# EasyEDA Pro project 碳化硅3KW图腾柱PFC_2025-04-21.epro, schematic Schematic1_1, sheets 4 to 6 of 6

## Sheets
4 驱动器: Page Name: 驱动器; Update Date: 2025-03-09
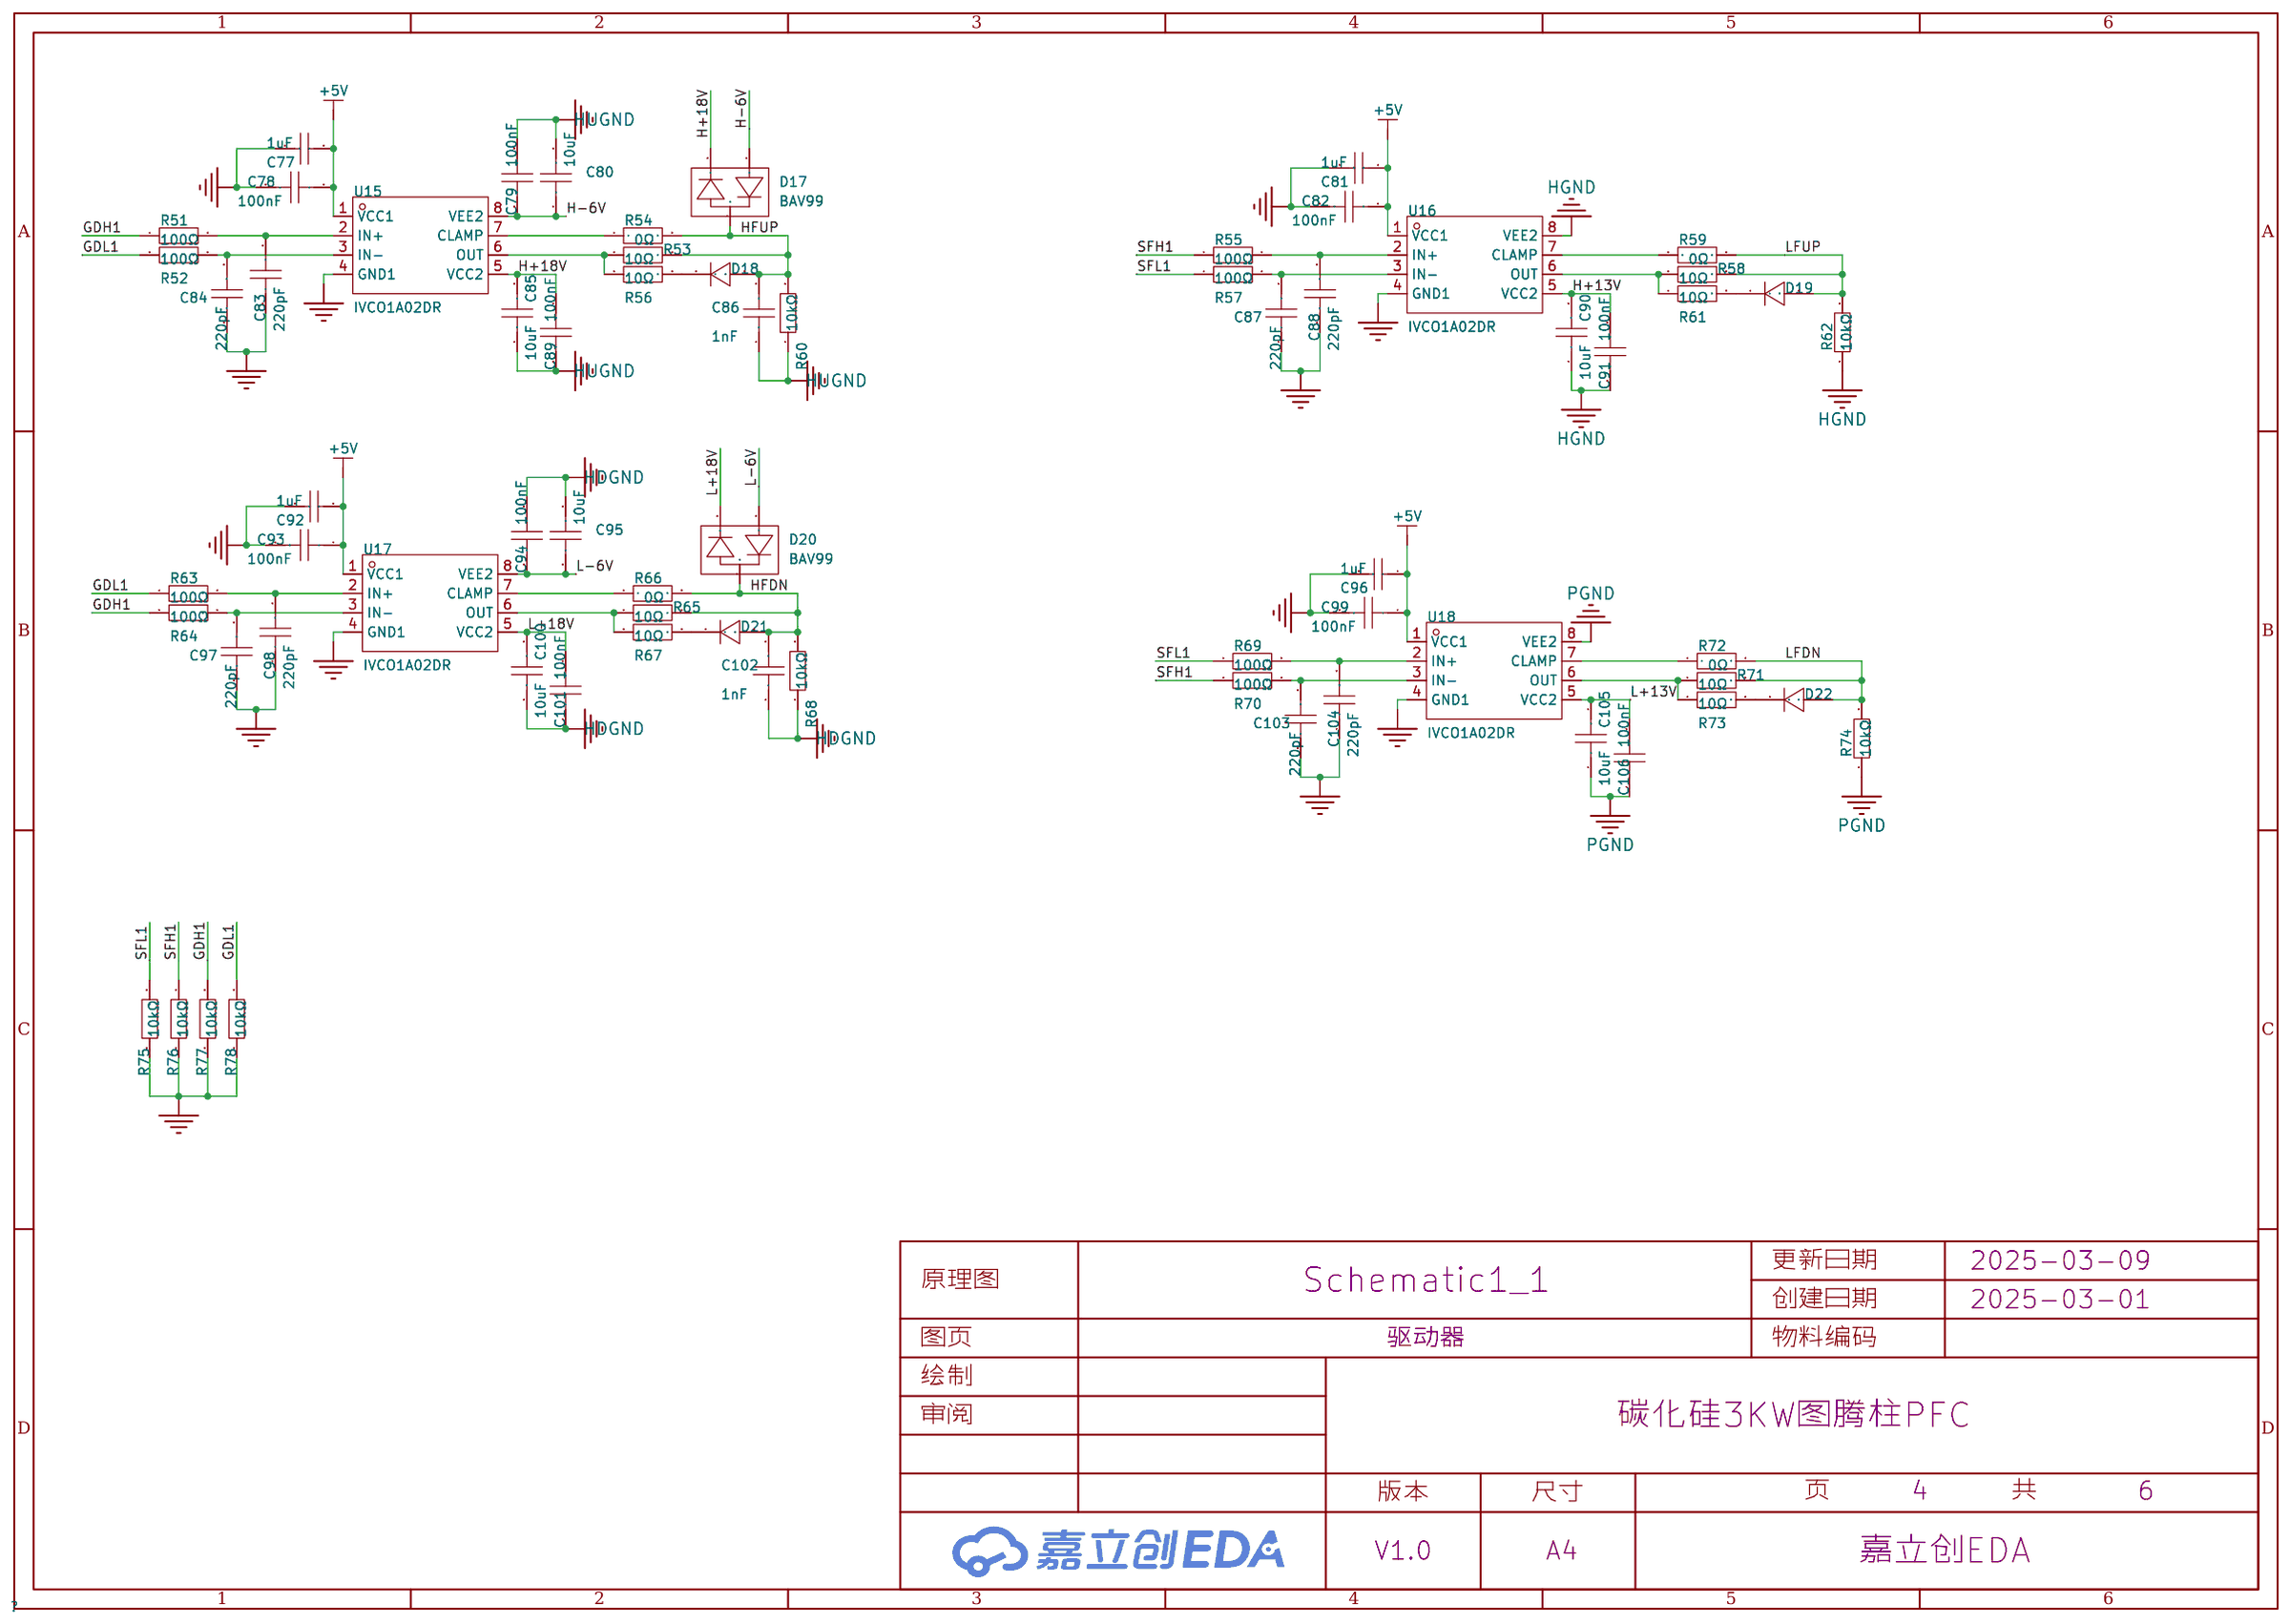
[diagram p3: 驱动器]
5 CW32主控: Create Date: 2024-07-14; Page Name: CW32主控; Project Name: 采用碳化硅的3KW图腾柱PFC; Update Date: 2024-07-19
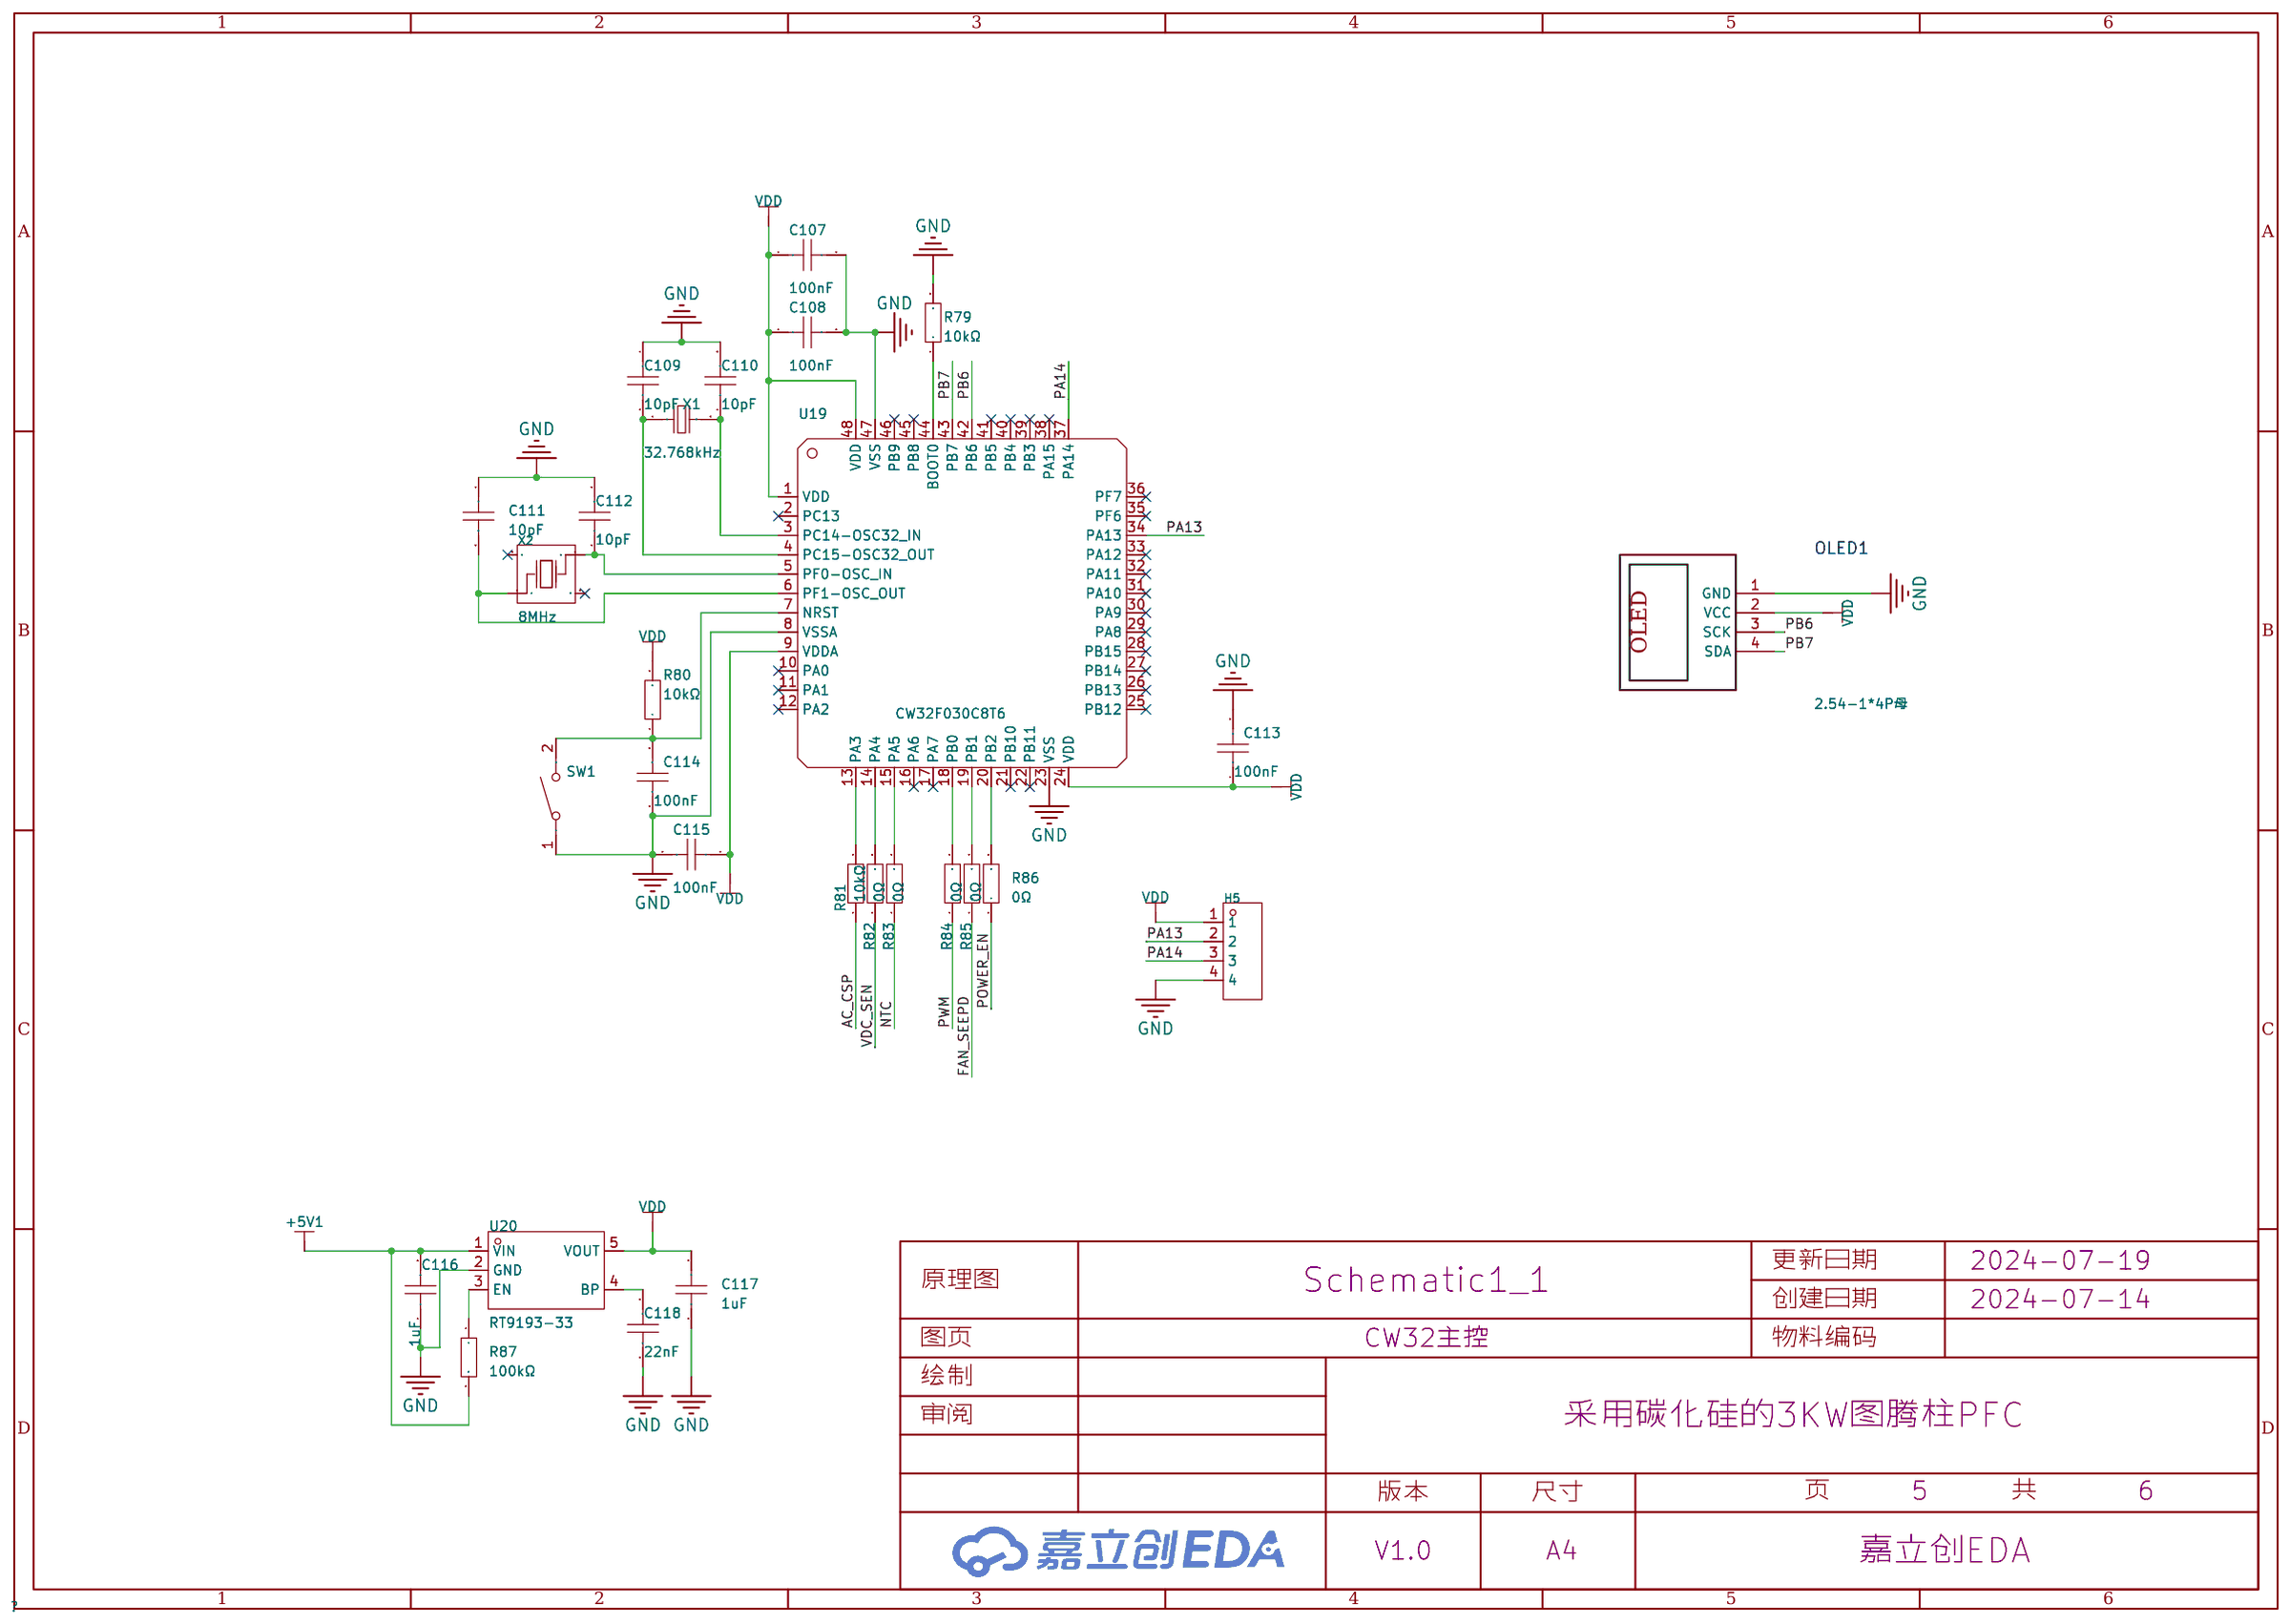
[diagram p4: CW32主控]
6 采样: Create Date: 2024-07-14; Page Name: 采样; Project Name: 采用碳化硅的3KW图腾柱PFC; Update Date: 2024-08-04
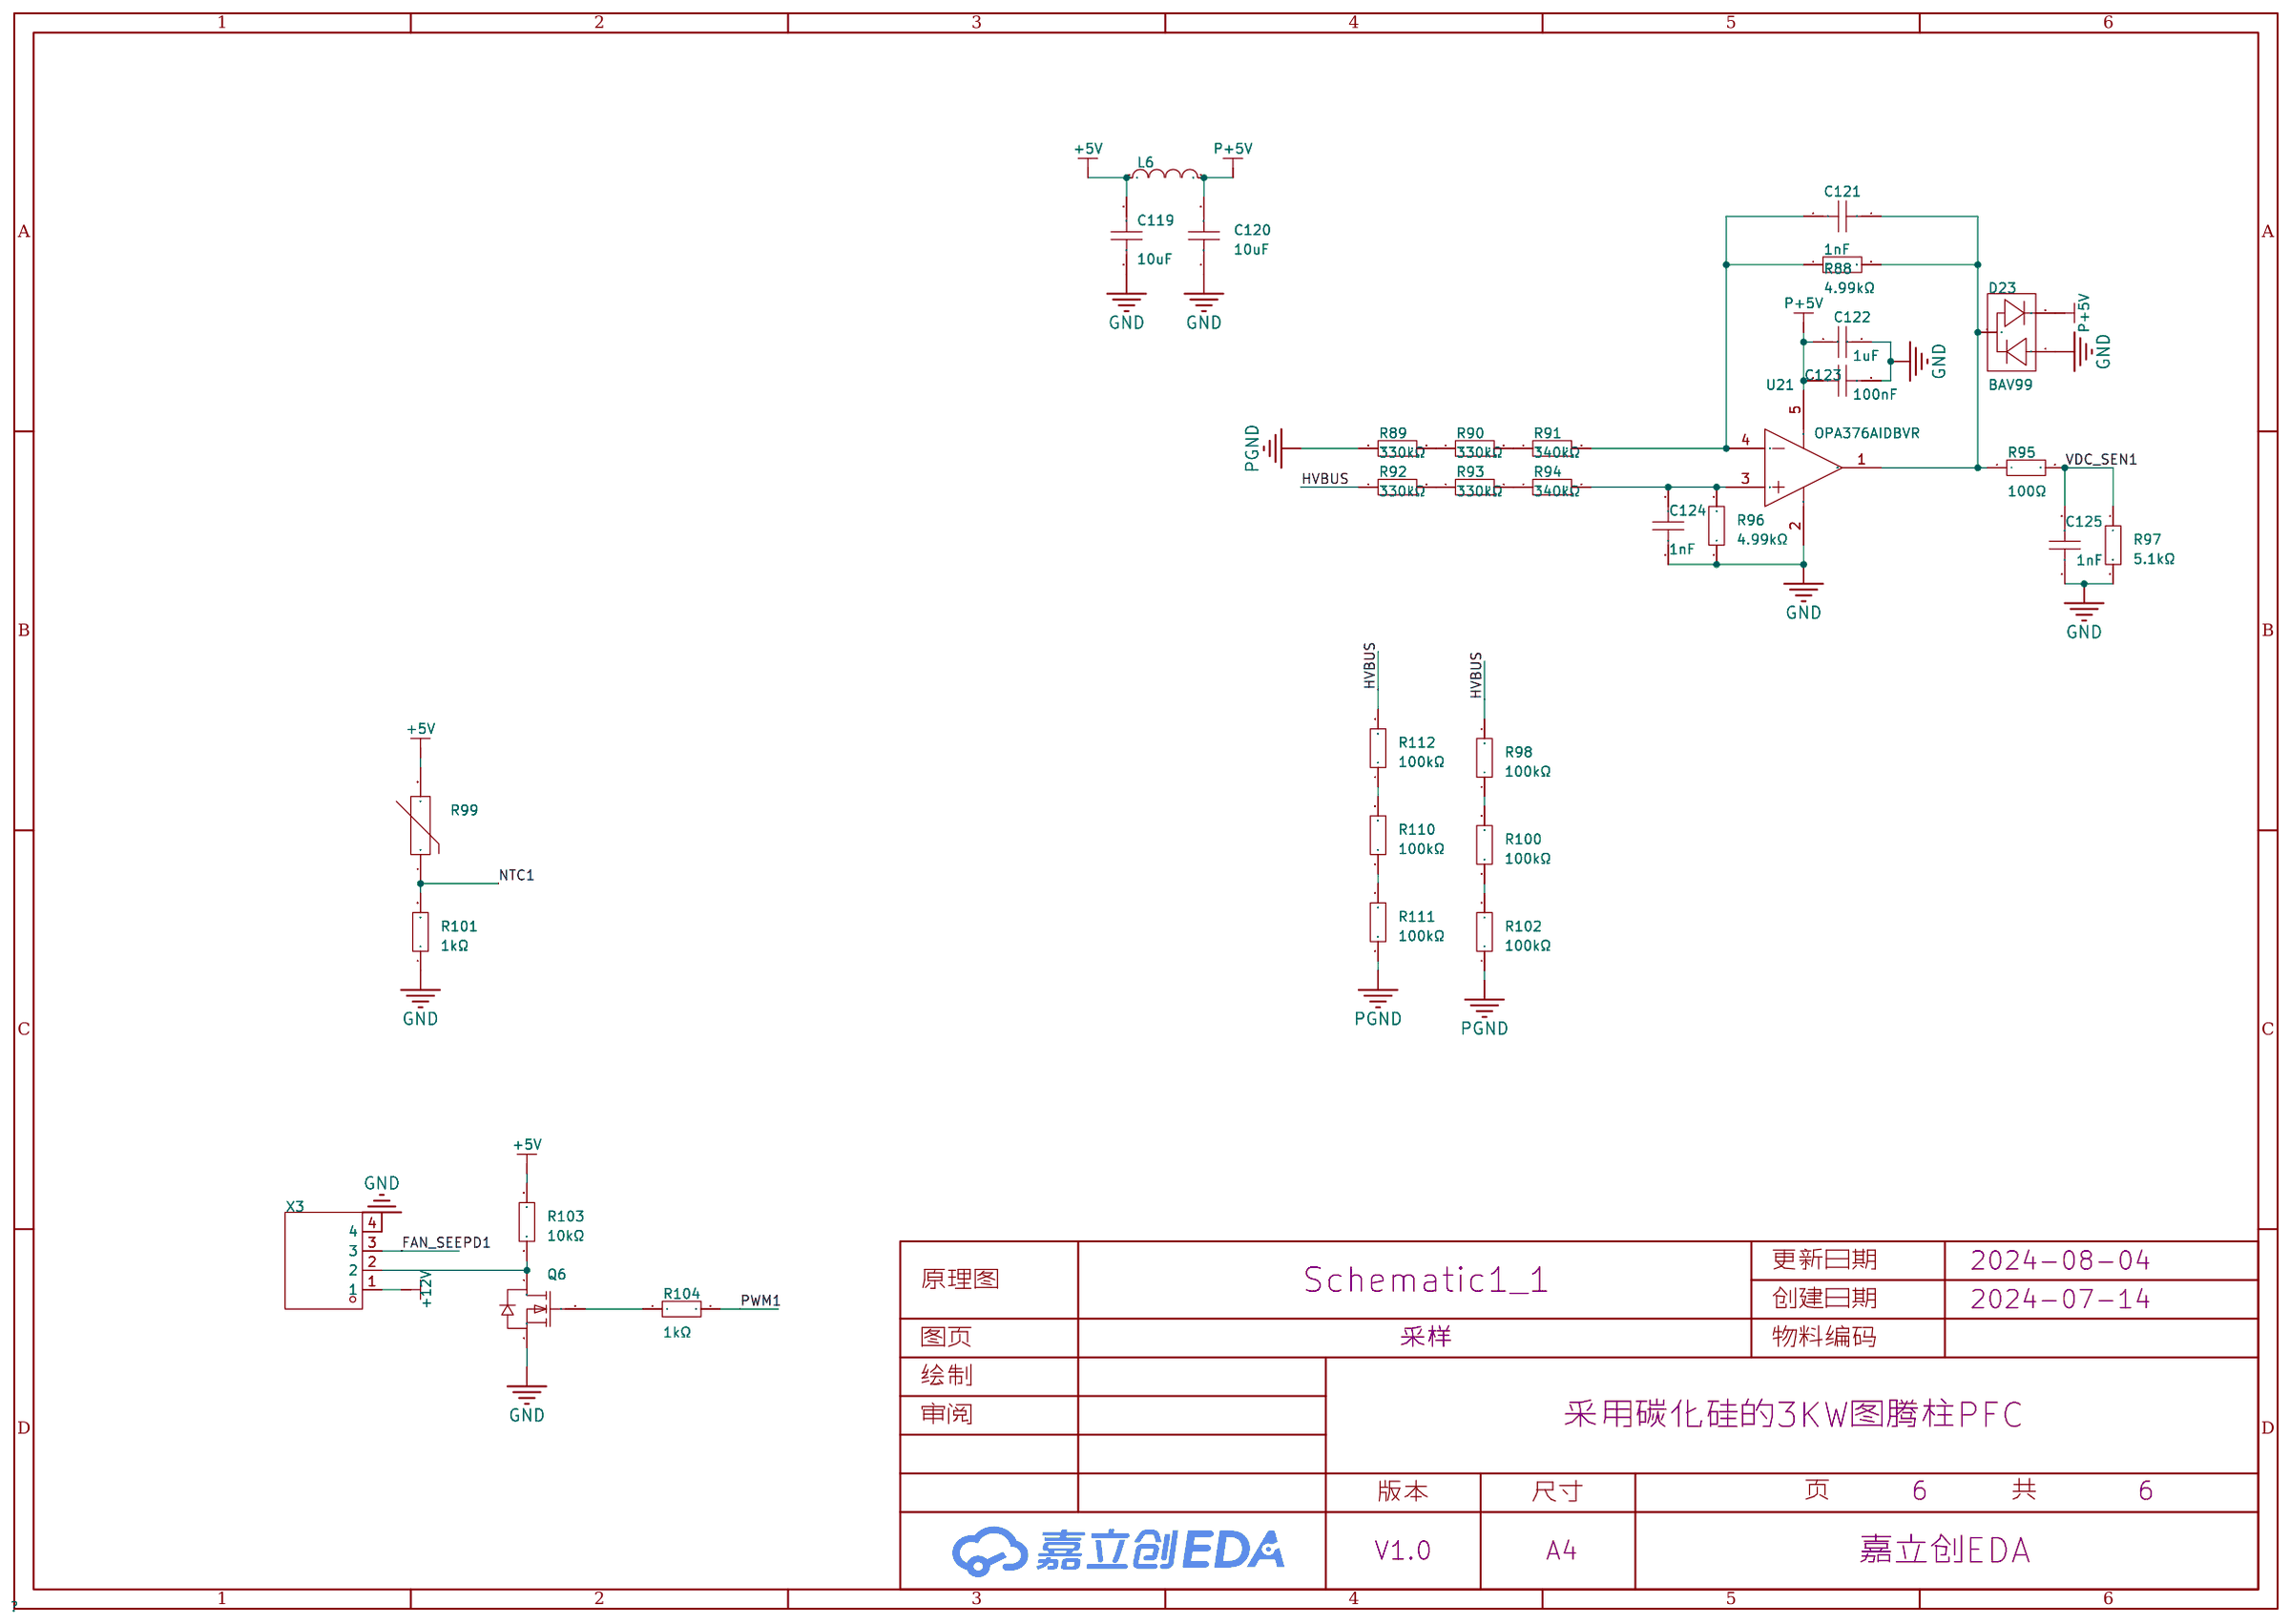
[diagram p5: 采样]

## Parts
sheet CW32主控
C107  100nF  [C0603]
C108  100nF  [C0603]
C109  10pF  [C0603]
C110  10pF  [C0603]
C111  10pF  [C0603]
C112  10pF  [C0603]
C113  100nF  [C0603]
C114  100nF  [C0603]
C115  100nF  [C0603]
C116  1uF  [C0603]
C117  1uF  [C0603]
C118  22nF  [C0603]
H5  -  [HDR-TH_4P-P2.54-V-M]
OLED1  2.54-1*4P母  [HDR-TH_4P-P2.54-V-F]
R79  10kΩ  [R0603]
R80  10kΩ  [R0603]
R81  10kΩ  [R0603]
R82  0Ω  [R0603]
R83  0Ω  [R0603]
R84  0Ω  [R0603]
R85  0Ω  [R0603]
R86  0Ω  [R0603]
R87  100kΩ  [R0603]
SW1  TS-1185EC-C-D-B  [SW-SMD_4P-L3.7-W3.0-P1.50-LS4.7]
U19  CW32F030C8T6  [LQFP-48_L7.0-W7.0-P0.50-LS9.0-TL]
U20  RT9193-33  [SOT-23-5_L2.9-W1.6-P0.95-LS2.8-TL]
X1  32.768kHz  [FC-135R_L3.2-W1.5]
X2  8MHz  [OSC-SMD_4P-L3.2-W2.5-BL]
sheet 采样
C119  10uF  [C0603]
C120  10uF  [C0603]
C121  1nF  [C0603]
C122  1uF  [C0603]
C123  100nF  [C0603]
C124  1nF  [C0603]
C125  1nF  [C0603]
D23  BAV99  [SOT-23-3_L2.9-W1.3-P1.90-LS2.4-BR]
L6  PBY160808T-601Y-N  [L0603]
Q6  2N7002  [SOT-23-3_L2.9-W1.3-P1.90-LS2.4-BR]
R88  4.99kΩ  [R0603]
R89  330kΩ  [R1206]
R90  330kΩ  [R1206]
R91  340kΩ  [R1206]
R92  330kΩ  [R1206]
R93  330kΩ  [R1206]
R94  340kΩ  [R1206]
R95  100Ω  [R0603]
R96  4.99kΩ  [R0603]
R97  5.1kΩ  [R0603]
R98  100kΩ  [R1206]
R99  MF52A103F3950 (A1)  [RES-TH_L2.5-W2.5-P1.70-D0.3]
R100  100kΩ  [R1206]
R101  1kΩ  [R0603]
R102  100kΩ  [R1206]
R103  10kΩ  [R0603]
R104  1kΩ  [R0603]
R110  100kΩ  [R1206]
R111  100kΩ  [R1206]
R112  100kΩ  [R1206]
U21  OPA376AIDBVR  [SOT-23-5_L3.0-W1.7-P0.95-LS2.8-BR]
X3  B04B-XASK-1(LF)(SN)  [CONN-TH_B04B-XASK-1-LF-SN]
sheet 驱动器
C77  1uF  [C0603]
C78  100nF  [C0603]
C79  100nF  [C0603]
C80  10uF  [C0603]
C81  1uF  [C0603]
C82  100nF  [C0603]
C83  220pF  [C0603]
C84  220pF  [C0603]
C85  10uF  [C1206]
C86  1nF  [C0603]
C87  220pF  [C0603]
C88  220pF  [C0603]
C89  100nF  [C0603]
C90  10uF  [C1206]
C91  100nF  [C0603]
C92  1uF  [C0603]
C93  100nF  [C0603]
C94  100nF  [C0603]
C95  10uF  [C0603]
C96  1uF  [C0603]
C97  220pF  [C0603]
C98  220pF  [C0603]
C99  100nF  [C0603]
C100  10uF  [C1206]
C101  100nF  [C0603]
C102  1nF  [C0603]
C103  220pF  [C0603]
C104  220pF  [C0603]
C105  10uF  [C1206]
C106  100nF  [C0603]
D17  BAV99  [SOT-23-3_L2.9-W1.3-P1.90-LS2.4-BR]
D18  SODSF14-SH  [SOD-123FL_L2.8-W1.8-LS3.7-RD-1]
D19  SODSF14-SH  [SOD-123FL_L2.8-W1.8-LS3.7-RD-1]
D20  BAV99  [SOT-23-3_L2.9-W1.3-P1.90-LS2.4-BR]
D21  SODSF14-SH  [SOD-123FL_L2.8-W1.8-LS3.7-RD-1]
D22  SODSF14-SH  [SOD-123FL_L2.8-W1.8-LS3.7-RD-1]
R51  100Ω  [R0603]
R52  100Ω  [R0603]
R53  10Ω  [R1206]
R54  0Ω  [R0805]
R55  100Ω  [R0603]
R56  10Ω  [R1206]
R57  100Ω  [R0603]
R58  10Ω  [R1206]
R59  0Ω  [R0805]
R60  10kΩ  [R0603]
R61  10Ω  [R1206]
R62  10kΩ  [R0603]
R63  100Ω  [R0603]
R64  100Ω  [R0603]
R65  10Ω  [R1206]
R66  0Ω  [R0805]
R67  10Ω  [R1206]
R68  10kΩ  [R0603]
R69  100Ω  [R0603]
R70  100Ω  [R0603]
R71  10Ω  [R1206]
R72  0Ω  [R0805]
R73  10Ω  [R1206]
R74  10kΩ  [R0603]
R75  10kΩ  [R0603]
R76  10kΩ  [R0603]
R77  10kΩ  [R0603]
R78  10kΩ  [R0603]
U15  IVCO1A02DR  [SOIC-8_L4.9-W4.0-P1.27-LS6.0-BL]
U16  IVCO1A02DR  [SOIC-8_L4.9-W4.0-P1.27-LS6.0-BL]
U17  IVCO1A02DR  [SOIC-8_L4.9-W4.0-P1.27-LS6.0-BL]
U18  IVCO1A02DR  [SOIC-8_L4.9-W4.0-P1.27-LS6.0-BL]

## Library data of the parts
C78 C79 C82 C89 C91 C93 C94 C99 C101 C106-C108 C113-C115 C123 = CC0603KRX7R9BB104: 容值:100nF;精度:±10%;额定电压:50V;材质(温度系数):X7R;; LCSC Part Name: 100nF ±10% 50V; Supplier Part: C14663; Manufacturer: YAGEO(国巨); Supplier Footprint: 0603; JLCPCB Part Class: Basic Part; Datasheet: https://atta.szlcsc.com/upload/public/pdf/source/20180910/C282072_33301C7F631E79921B82A8DAC6BCC5B3.pdf; Supplier: LCSC; Tolerance: ±10%; Voltage Rated: 50V; Temperature Coefficient: X7R
C109-C112 = CL10C100JB8NNNC: 容值:10pF;精度:±5%;额定电压:50V;材质(温度系数):C0G;; LCSC Part Name: 10pF ±5% 50V; Supplier Part: C1634; Manufacturer: SAMSUNG(三星); Supplier Footprint: 0603; JLCPCB Part Class: Basic Part; Datasheet: https://atta.szlcsc.com/upload/public/pdf/source/20160218/1457707763339.pdf; Supplier: LCSC; Tolerance: ±5%; Voltage Rated: 50V; Temperature Coefficient: C0G
C116 C117 = CL10A105KB8NNNC: 容值:1uF;精度:±10%;额定电压:50V;材质(温度系数):X5R;; LCSC Part Name: 1uF ±10% 50V; Supplier Part: C15849; Manufacturer: SAMSUNG(三星); Supplier Footprint: 0603; JLCPCB Part Class: Basic Part; Datasheet: https://atta.szlcsc.com/upload/public/pdf/source/20160218/1457707763339.pdf; Supplier: LCSC; Tolerance: ±10%; Voltage Rated: 50V; Temperature Coefficient: X5R
C118 = CL10B223KB8NNNC: 容值:22nF;精度:±10%;额定电压:50V;材质(温度系数):X7R;; LCSC Part Name: 22nF ±10% 50V; Supplier Part: C21122; Manufacturer: SAMSUNG(三星); Supplier Footprint: 0603; JLCPCB Part Class: Basic Part; Datasheet: https://atta.szlcsc.com/upload/public/pdf/source/20160218/1457707763339.pdf; Supplier: LCSC; Tolerance: ±10%; Voltage Rated: 50V; Temperature Coefficient: X7R
H5 = HDR-M_2.54_1x4P: Supplier Part: C492403; Supplier Footprint: 插件
OLED1 = 2.54-1*4P母: 插孔结构:1x4P;间距:2.54mm;行距:-;圆孔/方孔:方孔;安装类型:直插;排数:单排;总孔位数:4P;额定电流:3A;额定电压:-;插孔方向:顶部;塑高:-;触头材质:青铜;触头镀层:-;工作温度范围:-40℃~+105℃;焊接温度(最大值):-;; LCSC Part Name: 间距:2.54mm 1x4P 直插; Supplier Part: C2718488; Manufacturer: BOOMELE(博穆精密); Supplier Footprint: 插件,P=2.54mm; JLCPCB Part Class: Extended Part; Datasheet: https://atta.szlcsc.com/upload/public/pdf/source/20210301/C2718488_F4427B881E42CAA8DDB0B1C12B3A522C.pdf; Supplier: LCSC; Holes Structure: 1x4P; Pitch: 2.54mm; Circular Hole / Square Hole: 方孔; Mounting Type: 直插; Number of Rows: 单排; Number of Holes: 4P; Current Rating (Max): 3A; Holes Direction: 顶部; Contact Material: 青铜; Operating Temperature Range: -40℃~+105℃
R60 R62 R68 R74-R81 R103 = 0603WAF1002T5E: 电阻类型:厚膜电阻;阻值:10kΩ;精度:±1%;功率:100mW;最大工作电压:75V;温度系数:±100ppm/℃;; LCSC Part Name: 厚膜电阻 10kΩ ±1% 100mW; Supplier Part: C25804; Manufacturer: UNI-ROYAL(厚声); Supplier Footprint: 0603; JLCPCB Part Class: Basic Part; Datasheet: https://atta.szlcsc.com/upload/public/pdf/source/20200306/C422600_1E6D84923E4A46A82E41ADD87F860B5C.pdf; Supplier: LCSC; Type: 厚膜电阻; Tolerance: ±1%; Power(Watts): 100mW; Overload Voltage (Max): 75V; Temperature Coefficient: ±100ppm/℃; Operating Temperature Range: -55℃~+155℃
R82-R86 = 0603WAF0000T5E: 电阻类型:厚膜电阻;阻值:0Ω;精度:±1%;功率:100mW;最大工作电压:75V;; LCSC Part Name: 0Ω ±1% 100mW 厚膜电阻; Supplier Part: C21189; Manufacturer: UNI-ROYAL(厚声); Supplier Footprint: 0603; JLCPCB Part Class: Basic Part; Datasheet: https://atta.szlcsc.com/upload/public/pdf/source/20200306/C422600_1E6D84923E4A46A82E41ADD87F860B5C.pdf; Supplier: LCSC; Type: 厚膜电阻; Tolerance: ±1%; Power(Watts): 100mW; Overload Voltage (Max): 75V; Operating Temperature Range: -55℃~+155℃
R87 = 0603WAF1003T5E: 电阻类型:厚膜电阻;阻值:100kΩ;精度:±1%;功率:100mW;最大工作电压:75V;温度系数:±100ppm/℃;; LCSC Part Name: 100kΩ ±1% 100mW 厚膜电阻; Supplier Part: C25803; Manufacturer: UNI-ROYAL(厚声); Supplier Footprint: 0603; JLCPCB Part Class: Basic Part; Datasheet: https://atta.szlcsc.com/upload/public/pdf/source/20200306/C422600_1E6D84923E4A46A82E41ADD87F860B5C.pdf; Supplier: LCSC; Type: 厚膜电阻; Tolerance: ±1%; Power(Watts): 100mW; Overload Voltage (Max): 75V; Temperature Coefficient: ±100ppm/℃; Operating Temperature Range: -55℃~+155℃
SW1 = TS-1185EC-C-D-B: 触点电流:50mA;额定电压(DC):12V;绝缘电阻:-;电路结构:单刀单掷;安装方式:立贴;带灯:无;作用力:260gf;机械寿命:10万次;带支架:否;; LCSC Part Name: 3.65*3*2mm 立贴 轻触开关; Supplier Part: C318893; Manufacturer: XKB Connectivity(中国星坤); Supplier Footprint: SMD; JLCPCB Part Class: 扩展库; Datasheet: https://atta.szlcsc.com/upload/public/pdf/source/20211011/37251E5FC3BB5C155D4391B78D14163F.pdf; Supplier: LCSC; Contact Current: 50mA; Voltage Rating (DC): 12V; Circuit: 单刀单掷; Mounting Style: 立贴; Actuator Style: 圆形按钮; Actuator/Cap Color: 黑色; With Lamp: 无; Operating Force: 260gf; Mechanical Life: 10万次; Operating Temperature: -30℃~+85℃; Switch Length: 3.65mm; Switch Width: 3mm; Switch Height: 2mm; Strike Gundam: 否
U19 = CW32F030C8T6_C3019113: CPU内核:ARM Cortex-M0+;CPU最大主频:64MHz;工作电压范围:1.65V~5.5V;内部振荡器:有;外部时钟频率范围:4MHz~32MHz;程序 FLASH容量:-;RAM总容量:8KB;EEPROM/数据 FLASH容量:-;GPIO端口数量:39;ADC(单元数/通道数/位数):1@x16ch/12bit;DAC(单元数/通道数/位数):-;(E)PWM(单元数/通道数/位数):-;8位Timer数量:-;16位Timer数量:8;32位Timer数量:-;内部比较器数量:2;U; LCSC Part Name: ARM Cortex-M0+ 64MHz RAM：8KB; Supplier Part: C3019113; Manufacturer: CW(芯源); Supplier Footprint: LQFP-48; Datasheet: https://atta.szlcsc.com/upload/public/pdf/source/20220516/D60F5E1023A73FFF550D4A77416DDFBC.pdf; Supplier: LCSC; CPU Core: ARM Cortex-M0+; Maximum Frequency: 64MHz; Supply Voltage Range: 1.65V~5.5V; Internal Oscillator: 有; External Clock Frequency Rang: 4MHz~32MHz; RAM Size: 8KB; GPIO Ports Number: 39; ADC (Units/Channels/bits): 1@x16ch/12bit; 16Bit Timer Number: 8; CMP Number: 2; U(S)ART Number: 3; I2C Number: 2; (Q)SPI Number: 2; Peripherals / Functions / Protocol Stacks: 片载温度传感器；DMA；看门狗；低电压检测；CRC校验; Operating Temperature Range: -40℃~105℃
U20 = RT9193-33_C9900006434: Supplier Part: C9900006434; Supplier Footprint: LC-SOT-23-5; JLCPCB Part Class: 扩展库; Supplier: LCSC
X1 = Q13FC1350000400: 晶振类型:贴片晶振;频率:32.768kHz;常温频差:±20ppm;外接负载电容:12.5pF;; LCSC Part Name: 32.768kHz ±20ppm 12.5pF; Supplier Part: C32346; Manufacturer: EPSON(爱普生); Manufacturer Part: Q13FC13500004; Supplier Footprint: SMD3215-2P; JLCPCB Part Class: Basic Part; Datasheet: https://atta.szlcsc.com/upload/public/pdf/source/20240418/0E0FF5F0356BA3753F616001439D1416.pdf; Supplier: LCSC; Crystal Type: 贴片晶振; Frequency Tolerance: ±20ppm; Load Capacitance: 12.5pF; Equivalent Series Resistance (ESR): 70kΩ; Operating Temperature: -40℃~+85℃; Normal temperature Frequency Tolerance: ±20ppm; External load capacitor: 12.5pF
X2 = TAXM8M4RDBCCT2T: 晶振类型:贴片晶振;频率:8MHz;常温频差:±10ppm;外接负载电容:10pF;频率稳定度(全温):±15ppm;; LCSC Part Name: 8MHz ±10ppm 10pF; Supplier Part: C400090; Manufacturer: YJX(雅晶鑫); Supplier Footprint: SMD3225-4P; JLCPCB Part Class: Extended Part; Datasheet: https://atta.szlcsc.com/upload/public/pdf/source/20190626/C400090_CF95B89E745AFE4EF2E392EF8AC009D6.pdf; Supplier: LCSC; Crystal Type: 贴片晶振; Frequency Tolerance: ±10ppm; Frequency Stability: ±15ppm; Load Capacitance: 10pF; Equivalent Series Resistance (ESR): 250Ω; Operating Temperature: -40℃~+85℃; Normal temperature Frequency Tolerance: ±10ppm; External load capacitor: 10pF; Frequency Stability(Full temperature range): ±15ppm
C80 C95 C119 C120 = CL10A106MA8NRNC: 容值:10uF;精度:±20%;额定电压:25V;材质(温度系数):X5R;; LCSC Part Name: 10uF ±20% 25V; Supplier Part: C96446; Manufacturer: SAMSUNG(三星); Supplier Footprint: 0603; JLCPCB Part Class: 基础库; Datasheet: https://atta.szlcsc.com/upload/public/pdf/source/20160218/1457707763339.pdf; Supplier: LCSC; Tolerance: ±20%; Voltage Rated: 25V; Temperature Coefficient: X5R
C86 C102 C121 C124 C125 = CL10B102KB8NNNC: 容值:1nF;精度:±10%;额定电压:50V;材质(温度系数):X7R;; LCSC Part Name: 1nF ±10% 50V; Supplier Part: C1588; Manufacturer: SAMSUNG(三星); Supplier Footprint: 0603; JLCPCB Part Class: Basic Part; Datasheet: https://atta.szlcsc.com/upload/public/pdf/source/20160218/1457707763339.pdf; Supplier: LCSC; Tolerance: ±10%; Voltage Rated: 50V; Temperature Coefficient: X7R
C77 C81 C92 C96 C122 = 0603B105K250NT: 容值:1uF;精度:±10%;额定电压:25V;材质(温度系数):X7R;; Supplier: LCSC; Manufacturer: FH(风华); Supplier Part: C59302; JLCPCB Part Class: 扩展库; LCSC Part Name: 1uF ±10% 25V; Supplier Footprint: 0603; Datasheet: https://atta.szlcsc.com/upload/public/pdf/source/20200305/C486355_26A10D38EF8C2A5C37091D0039909270.pdf; Tolerance: ±10%; Voltage Rated: 25V; Temperature Coefficient: X7R
D17 D20 D23 = BAV99_C916421: 二极管配置:1对串联式;正向压降(Vf):1.25V@150mA;直流反向耐压(Vr):75V;平均整流电流(Io):215mA;功率:350mW;反向恢复时间(trr):4ns;; LCSC Part Name: 电压:75V 电流:215mA; Supplier Part: C916421; Manufacturer: JSMSEMI(杰盛微); Supplier Footprint: SOT-23; JLCPCB Part Class: 扩展库; Datasheet: https://atta.szlcsc.com/upload/public/pdf/source/20230807/11783D3585FB2C3082AA42FFBDFBC934.pdf; Supplier: LCSC; Diode Configuration: 1对串联式; Forward Voltage (Vf@If): 1.25V@150mA; Reverse Voltage (Vr): 75V; Average Rectified Current (Io): 215mA; Power Dissipation: 350mW; Reverse Leakage Current: 1uA@75V; Reverse Recovery Time (trr): 4ns
L6 = PBY160808T-601Y-N: 标称阻抗@测试频率:600Ω@100MHz;误差:±25%;直流电阻(RDC):200mΩ;; LCSC Part Name: 单路 0603磁珠 阻抗600Ω@100MHz; Supplier Part: C108301; Manufacturer: chilisin(奇力新); Supplier Footprint: 0603; JLCPCB Part Class: 扩展库; Datasheet: https://atta.szlcsc.com/upload/public/pdf/source/20171211/C142062_15129612555301174265.pdf; Supplier: LCSC; Impedance @ Frequency: 600Ω@100MHz; Tolerance: ±25%; DC Resistance: 200mΩ; Current Rating: 1A; Circuits: 1
Q6 = 2N7002_C8545: 类型:N沟道;漏源电压(Vdss):60V;连续漏极电流(Id):115mA;功率(Pd):200mW;导通电阻(RDS(on)@Vgs,Id):7.5Ω@10V,500mA;阈值电压(Vgs(th)@Id):2.5V@250uA;; LCSC Part Name: N沟道 耐压:60V 电流:115mA; Supplier Part: C8545; Manufacturer: CJ(江苏长电/长晶); Supplier Footprint: SOT-23; JLCPCB Part Class: 基础库; Datasheet: https://atta.szlcsc.com/upload/public/pdf/source/20171228/C164913_15144413269051213916.pdf; Supplier: LCSC; Type: N沟道; Drain Source Voltage (Vdss): 60V; Continuous Drain Current (Id): 115mA; Power Dissipation (Pd): 200mW; Drain Source On Resistance (RDS(on)@Vgs,Id): 7.5Ω@10V,500mA; Gate Threshold Voltage (Vgs(th)@Id): 2.5V@250uA
R88 R96 = 0603WAF4991T5E: 电阻类型:厚膜电阻;阻值:4.99kΩ;精度:±1%;功率:100mW;最大工作电压:75V;温度系数:±100ppm/℃;; LCSC Part Name: 4.99kΩ ±1% 100mW 厚膜电阻; Supplier Part: C23046; Manufacturer: UNI-ROYAL(厚声); Supplier Footprint: 0603; JLCPCB Part Class: Basic Part; Datasheet: https://atta.szlcsc.com/upload/public/pdf/source/20200306/C422600_1E6D84923E4A46A82E41ADD87F860B5C.pdf; Supplier: LCSC; Type: 厚膜电阻; Tolerance: ±1%; Power(Watts): 100mW; Overload Voltage (Max): 75V; Temperature Coefficient: ±100ppm/℃; Operating Temperature Range: -55℃~+155℃
R89 R90 R92 R93 = 1206W4F3303T5E: 电阻类型:厚膜电阻;阻值:330kΩ;精度:±1%;功率:250mW;最大工作电压:200V;温度系数:±100ppm/℃;; LCSC Part Name: 330kΩ ±1% 250mW 厚膜电阻; Supplier Part: C17929; Manufacturer: UNI-ROYAL(厚声); Supplier Footprint: 1206; JLCPCB Part Class: Extended Part; Datasheet: https://atta.szlcsc.com/upload/public/pdf/source/20200306/C422600_1E6D84923E4A46A82E41ADD87F860B5C.pdf; Supplier: LCSC; Type: 厚膜电阻; Tolerance: ±1%; Power(Watts): 250mW; Overload Voltage (Max): 200V; Temperature Coefficient: ±100ppm/℃; Operating Temperature Range: -55℃~+155℃
R91 R94 = RS-06K3403FT: 电阻类型:厚膜电阻;阻值:340kΩ;精度:±1%;功率:250mW;最大工作电压:200V;温度系数:±100ppm/℃;; LCSC Part Name: 厚膜电阻 340kΩ ±1% 250mW; Supplier Part: C310348; Manufacturer: FH(风华); Supplier Footprint: 1206; JLCPCB Part Class: Extended Part; Datasheet: https://atta.szlcsc.com/upload/public/pdf/source/20140616/1457707091974.pdf; Supplier: LCSC; Type: 厚膜电阻; Tolerance: ±1%; Power(Watts): 250mW; Overload Voltage (Max): 200V; Temperature Coefficient: ±100ppm/℃; Operating Temperature Range: -55℃~+155℃
R51 R52 R55 R57 R63 R64 R69 R70 R95 = 0603WAF1000T5E: 电阻类型:厚膜电阻;阻值:100Ω;精度:±1%;功率:100mW;最大工作电压:75V;温度系数:±200ppm/℃;; LCSC Part Name: 100Ω ±1% 100mW 厚膜电阻; Supplier Part: C22775; Manufacturer: UNI-ROYAL(厚声); Supplier Footprint: 0603; JLCPCB Part Class: Basic Part; Datasheet: https://atta.szlcsc.com/upload/public/pdf/source/20200306/C422600_1E6D84923E4A46A82E41ADD87F860B5C.pdf; Supplier: LCSC; Type: 厚膜电阻; Tolerance: ±1%; Power(Watts): 100mW; Overload Voltage (Max): 75V; Temperature Coefficient: ±200ppm/℃; Operating Temperature Range: -55℃~+155℃
R97 = 0603WAF5101T5E: 电阻类型:厚膜电阻;阻值:5.1kΩ;精度:±1%;功率:100mW;最大工作电压:75V;温度系数:±100ppm/℃;; LCSC Part Name: 5.1kΩ ±1% 100mW 厚膜电阻; Supplier Part: C23186; Manufacturer: UNI-ROYAL(厚声); Supplier Footprint: 0603; JLCPCB Part Class: Basic Part; Datasheet: https://atta.szlcsc.com/upload/public/pdf/source/20200306/C422600_1E6D84923E4A46A82E41ADD87F860B5C.pdf; Supplier: LCSC; Type: 厚膜电阻; Tolerance: ±1%; Power(Watts): 100mW; Overload Voltage (Max): 75V; Temperature Coefficient: ±100ppm/℃; Operating Temperature Range: -55℃~+155℃
R98 R100 R102 R110-R112 = 1206W4F1003T5E: 电阻类型:厚膜电阻;阻值:100kΩ;精度:±1%;功率:250mW;最大工作电压:200V;温度系数:±100ppm/℃;; LCSC Part Name: 100kΩ ±1% 250mW 厚膜电阻; Supplier Part: C17900; Manufacturer: UNI-ROYAL(厚声); Supplier Footprint: 1206; JLCPCB Part Class: Basic Part; Datasheet: https://atta.szlcsc.com/upload/public/pdf/source/20200306/C422600_1E6D84923E4A46A82E41ADD87F860B5C.pdf; Supplier: LCSC; Type: 厚膜电阻; Tolerance: ±1%; Power(Watts): 250mW; Overload Voltage (Max): 200V; Temperature Coefficient: ±100ppm/℃; Operating Temperature Range: -55℃~+155℃
R99 = MF52A103F3950 (A1): 阻值(25℃):10kΩ;B值(25℃/50℃):3950K;电阻精度:±1%;功率:50mW;B值精度:±1%;最大稳态电流(25℃):-;; LCSC Part Name: 10kΩ 电阻精度:±1% 3950K; Supplier Part: C13879; Manufacturer: 时恒; Supplier Footprint: 插件,P=1.7mm; JLCPCB Part Class: 扩展库; Datasheet: https://atta.szlcsc.com/upload/public/pdf/source/20181018/C324070_6015F64EA824A635FDB9BBFA1E1FD5FE.pdf; Supplier: LCSC; Resistance @ 25℃: 10kΩ; B Constant (25℃/50℃): 3950K; Resistance Tolerance: ±1%; Power: 50mW; B Constant Tolerance: ±1%; Operating Temperature: -55℃~+125℃
R101 R104 = 0603WAF1001T5E: 电阻类型:厚膜电阻;阻值:1kΩ;精度:±1%;功率:100mW;最大工作电压:75V;温度系数:±100ppm/℃;; LCSC Part Name: 1kΩ ±1% 100mW 厚膜电阻; Supplier Part: C21190; Manufacturer: UNI-ROYAL(厚声); Supplier Footprint: 0603; JLCPCB Part Class: Basic Part; Datasheet: https://atta.szlcsc.com/upload/public/pdf/source/20200306/C422600_1E6D84923E4A46A82E41ADD87F860B5C.pdf; Supplier: LCSC; Type: 厚膜电阻; Tolerance: ±1%; Power(Watts): 100mW; Overload Voltage (Max): 75V; Temperature Coefficient: ±100ppm/℃; Operating Temperature Range: -55℃~+155℃
U21 = OPA376AIDBVR: 放大器数:单路;增益带宽积(GBP):5.5MHz;输入偏置电流(Ib):0.2pA;压摆率(SR):2V/us;轨到轨:-;; Supplier Part: C42134; Manufacturer: TI(德州仪器); Supplier Footprint: SOT-23-5; JLCPCB Part Class: 扩展库; Datasheet: https://www.ti.com/cn/lit/gpn/opa376; Supplier: LCSC; Number of Circuits: 单路; Gain Bandwidth Product(GBP): 5.5MHz; Current - Input Bias(Ib): 0.2pA; Slew Rate(SR): 2V/us; Output Current: 50mA; Supply Current: 760uA; Operating Temperature: -40℃~+125℃
X3 = B04B-XASK-1(LF)(SN): 插针结构:1x4P;间距:2.5mm;安装方式:直插;参考系列:XA;总PIN数:4P;排数:1;每排PIN数:4;行距:-;额定电流:3A;触头材质:铜合金;触头镀层:锡;工作温度范围:-25℃~+85℃;; LCSC Part Name: 1x4P 间距:2.5mm 直插 系列:XA; Supplier Part: C264994; Manufacturer: JST; Supplier Footprint: 插件,P=2.5mm; JLCPCB Part Class: 扩展库; Datasheet: https://atta.szlcsc.com/upload/public/pdf/source/20180829/C265077_AACBE43BFB9344D794AFC81CB60287FF.pdf; Supplier: LCSC; Pins Structure: 1x4P; Pitch: 2.5mm; Mounting Style: 直插; Reference Series: XA; Number of Pins: 4P; Number of Rows: 1; Number of PINs Per Row: 4; Current Rating (Max): 3A; Contact Material: 铜合金; Contact Plating: 锡; Operating Temperature Range: -25℃~+85℃; Rated Voltage (Max): 250V; Plastic Material: 玻纤增强PA66; Flame Retardant Rating: UL94V-0; Supplementary Features: 打K脚; Colour: 白色; Z-Height of the Board: 8.8mm; X-Length of Bottom Edge on Board (Spacing Line): 12.5mm; Y-Width of Bottom Edge on Board: 6.4mm
C83 C84 C87 C88 C97 C98 C103 C104 = CL10B221KB8NNNC: 容值:220pF;精度:±10%;额定电压:50V;材质(温度系数):X7R;; LCSC Part Name: 220pF ±10% 50V; Supplier Part: C1603; Manufacturer: SAMSUNG(三星); Supplier Footprint: 0603; JLCPCB Part Class: Basic Part; Datasheet: https://atta.szlcsc.com/upload/public/pdf/source/20160218/1457707763339.pdf; Supplier: LCSC; Tolerance: ±10%; Voltage Rated: 50V; Temperature Coefficient: X7R
C85 C90 C100 C105 = CL31B106KBHNNNE: 容值:10uF;精度:±10%;额定电压:50V;材质(温度系数):X7R;; LCSC Part Name: 10uF ±10% 50V; Supplier Part: C89632; Manufacturer: SAMSUNG(三星); Supplier Footprint: 1206; JLCPCB Part Class: 扩展库; Datasheet: https://atta.szlcsc.com/upload/public/pdf/source/20161130/1480498807789.pdf; Supplier: LCSC; Tolerance: ±10%; Voltage Rated: 50V; Temperature Coefficient: X7R
D18 D19 D21 D22 = SODSF14-SH: 正向压降(Vf):950mV;直流反向耐压(Vr):200V;平均整流电流(Io):1A;; LCSC Part Name: 电压:200V 电流:1A; Supplier Part: C525408; Manufacturer: LRC(乐山无线电); Supplier Footprint: SOD-123FL; JLCPCB Part Class: 扩展库; Datasheet: https://atta.szlcsc.com/upload/public/pdf/source/20200430/C525395_817DEE701CDC777A0CDAEC0E785B1095.pdf; Supplier: LCSC; Forward Voltage (Vf@If): 950mV; Reverse Voltage (Vr): 200V; Average Rectified Current (Io): 1A; Reverse Leakage Current: 5uA
R53 R56 R58 R61 R65 R67 R71 R73 = 1206W4F100JT5E: 电阻类型:厚膜电阻;阻值:10Ω;精度:±1%;功率:250mW;最大工作电压:200V;温度系数:±400ppm/℃;; LCSC Part Name: 10Ω ±1% 250mW 厚膜电阻; Supplier Part: C17903; Manufacturer: UNI-ROYAL(厚声); Supplier Footprint: 1206; JLCPCB Part Class: Basic Part; Datasheet: https://atta.szlcsc.com/upload/public/pdf/source/20200306/C422600_1E6D84923E4A46A82E41ADD87F860B5C.pdf; Supplier: LCSC; Type: 厚膜电阻; Tolerance: ±1%; Power(Watts): 250mW; Overload Voltage (Max): 200V; Temperature Coefficient: ±400ppm/℃; Operating Temperature Range: -55℃~+155℃
R54 R59 R66 R72 = 0805W8F0000T5E: 电阻类型:厚膜电阻;阻值:0Ω;精度:±1%;功率:125mW;最大工作电压:150V;温度系数:±800ppm/℃;; LCSC Part Name: 0Ω ±1% 125mW 厚膜电阻; Supplier Part: C17477; Manufacturer: UNI-ROYAL(厚声); Supplier Footprint: 0805; JLCPCB Part Class: Basic Part; Datasheet: https://atta.szlcsc.com/upload/public/pdf/source/20200306/C422600_1E6D84923E4A46A82E41ADD87F860B5C.pdf; Supplier: LCSC; Type: 厚膜电阻; Tolerance: ±1%; Power(Watts): 125mW; Overload Voltage (Max): 150V; Temperature Coefficient: ±800ppm/℃; Operating Temperature Range: -55℃~+155℃
U15-U18 = IVCO1A02DR: 10A 3.75kVrms隔离型 单通道驱动器; LCSC Part Name: 10A 3.75kVrms隔离型 单通道驱动器 隔离驱动IC; Supplier Part: C5806823; Manufacturer: inventchip(瞻芯电子); Supplier Footprint: NBSOIC-8; JLCPCB Part Class: 扩展库; Datasheet: https://atta.szlcsc.com/upload/public/pdf/source/20230601/65F8BC05141595D861C7672A8E684702.pdf; Supplier: LCSC

## Nets
+5V: C77.1 C78.1 C81.1 C82.1 C92.1 C93.1 C96.1 C99.1 C119.2 L6.1 R99.2 R103.2 U15.1(VCC1) U16.1(VCC1) U17.1(VCC1) U18.1(VCC1) ; also on sheet 2 3
+5V1: C116.2 R87.2 U20.1(VIN) ; also on sheet 2
+12V: X3.1 ; also on sheet 1 3
GND: C77.2 C78.2 C81.2 C82.2 C83.1 C84.1 C87.1 C88.1 C92.2 C93.2 C96.2 C97.1 C98.1 C99.2 C103.1 C104.1 C107.2 C108.2 C109.1 C110.2 C111.1 C112.2 C113.2 C114.1 C115.2 C116.1 C117.1 C118.1 C119.1 C120.1 C122.1 C123.2 C124.2 C125.1 D23.1 H5.4 OLED1.1(GND) Q6.2(S) R75.1 R76.1 R77.1 R78.1 R79.2 R96.1 R97.2 R101.1 SW1.1 U15.4(GND1) U16.4(GND1) U17.4(GND1) U18.4(GND1) U19.8(VSSA) U19.23(VSS) U19.47(VSS) U20.2(GND) U21.2(V-) X3.4 ; also on sheet 1 2 3
PGND: C105.1 C106.1 R74.1 R89.1 R102.1 R111.1 U18.8(VEE2) ; also on sheet 1 3
VDD: C107.1 C108.1 C113.1 C115.1 C117.2 H5.1 OLED1.2(VCC) R80.2 U19.1(VDD) U19.9(VDDA) U19.24(VDD) U19.48(VDD) U20.5(VOUT)
AC_CSP: R81.1 ; also on sheet 2
FAN_SEEPD: R85.1 ; also on sheet 2
FAN_SEEPD1: X3.3 ; also on sheet 2
GDH1: R51.1 R64.1 R77.2 ; also on sheet 2
GDL1: R52.1 R63.1 R78.2 ; also on sheet 2
H+13V: C90.2 C91.2 U16.5(VCC2) ; also on sheet 3
H+18V: C85.2 C89.2 D17.2 U15.5(VCC2) ; also on sheet 3
H-6V: C79.1 C80.1 D17.1 U15.8(VEE2) ; also on sheet 3
HDGND: C94.2 C95.2 C100.1 C101.1 C102.1 R68.1 ; also on sheet 1 3
HFDN: C102.2 D20.3 D21.2 R65.2 R66.2 R68.2 ; also on sheet 1
HFUP: C86.2 D17.3 D18.2 R53.2 R54.2 R60.2 ; also on sheet 1
HGND: C90.1 C91.1 R62.1 U16.8(VEE2) ; also on sheet 1 3
HUGND: C79.2 C80.2 C85.1 C86.1 C89.1 R60.1 ; also on sheet 1 3
HVBUS: R92.1 R98.2 R112.2 ; also on sheet 1
L+13V: C105.2 C106.2 U18.5(VCC2) ; also on sheet 3
L+18V: C100.2 C101.2 D20.2 U17.5(VCC2) ; also on sheet 3
L-6V: C94.1 C95.1 D20.1 U17.8(VEE2) ; also on sheet 3
LFDN: D22.2 R71.2 R72.2 R74.2
LFUP: D19.2 R58.2 R59.2 R62.2
NTC: R83.1 ; also on sheet 2
NTC1: R99.1 R101.2 ; also on sheet 2
P+5V: C120.2 C122.2 C123.1 D23.2 L6.2 U21.5(V+) ; also on sheet 1
PA13: H5.2 U19.34(PA13)
PA14: H5.3 U19.37(PA14)
PB6: OLED1.3(SCK) U19.42(PB6)
PB7: OLED1.4(SDA) U19.43(PB7)
POWER_EN: R86.1 ; also on sheet 2
PWM: R84.1 ; also on sheet 2
PWM1: R104.2 ; also on sheet 2
SFH1: R55.1 R70.1 R76.2 ; also on sheet 2
SFL1: R57.1 R69.1 R75.2 ; also on sheet 2
VDC_SEN: R82.1 ; also on sheet 2
VDC_SEN1: C125.2 R95.2 R97.1 ; also on sheet 2
$4N1776: R53.1 R56.1 U15.6(OUT)
$4N1777: D18.1 R56.2
$4N1782: C83.2 R51.2 U15.2(IN+)
$4N1785: C84.2 R52.2 U15.3(IN-)
$4N1793: R54.1 U15.7(CLAMP)
$4N1821: R65.1 R67.1 U17.6(OUT)
$4N1822: D21.1 R67.2
$4N1827: C98.2 R63.2 U17.2(IN+)
$4N1830: C97.2 R64.2 U17.3(IN-)
$4N1838: R66.1 U17.7(CLAMP)
$4N1867: R58.1 R61.1 U16.6(OUT)
$4N1868: D19.1 R61.2
$4N1869: C88.2 R55.2 U16.2(IN+)
$4N1872: C87.2 R57.2 U16.3(IN-)
$4N1880: R59.1 U16.7(CLAMP)
$4N2401: R71.1 R73.1 U18.6(OUT)
$4N2402: D22.1 R73.2
$4N2403: C104.2 R69.2 U18.2(IN+)
$4N2406: C103.2 R70.2 U18.3(IN-)
$4N2414: R72.1 U18.7(CLAMP)
$5N1031: C112.1 U19.5(PF0-OSC_IN) X2.3
$5N1032: C111.2 U19.6(PF1-OSC_OUT) X2.1
$5N1034: C110.1 U19.3(PC14-OSC32_IN) X1.2
$5N1035: C109.2 U19.4(PC15-OSC32_OUT) X1.1
$5N1051: R79.1 U19.44(BOOT0)
$5N1060: R82.2 U19.14(PA4)
$5N1064: R83.2 U19.15(PA5)
$5N1068: C114.2 R80.1 SW1.2 U19.7(NRST)
$5N1385: C118.2 U20.4(BP)
$5N1387: R87.1 U20.3(EN)
$5N1545: R81.2 U19.13(PA3)
$5N1711: R84.2 U19.18(PB0)
$5N1714: R85.2 U19.19(PB1)
$5N1723: R86.2 U19.20(PB2)
$6N1486: C121.1 D23.3 R88.2 R95.1 U21.1(OUT)
$6N1487: C124.1 R94.2 R96.2 U21.3(IN+)
$6N1488: C121.2 R88.1 R91.2 U21.4(IN-)
$6N1489: R90.2 R91.1
$6N1490: R89.2 R90.1
$6N1491: R93.2 R94.1
$6N1492: R92.2 R93.1
$6N1763: Q6.3(D) R103.1 X3.2
$6N4300: Q6.1(G) R104.1
$6N6920: R98.1 R100.2
$6N6921: R100.1 R102.2
$6N11891: R110.2 R112.1
$6N11892: R110.1 R111.2

Not connected (* = marked no-connect by the designer): U19 2(PC13)* 10(PA0)* 11(PA1)* 12(PA2)* 16(PA6)* 17(PA7)* 21(PB10)* 22(PB11)* 25(PB12)* 26(PB13)* 27(PB14)* 28(PB15)* 29(PA8)* 30(PA9)* 31(PA10)* 32(PA11)* 33(PA12)* 35(PF6)* 36(PF7)* 38(PA15)* 39(PB3)* 40(PB4)* 41(PB5)* 45(PB8)* 46(PB9)*; X2 2* 4*
